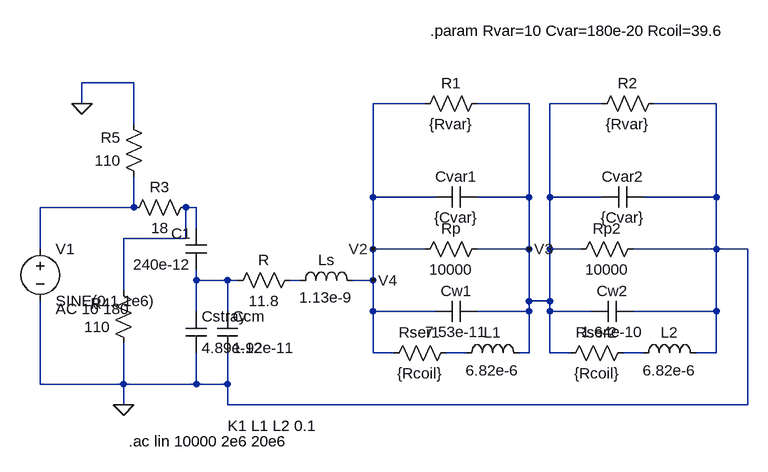
[diagram p0: schematic Coil_Model - Pi_matching_flat_current.asc]
Coil_Model - Pi_matching_flat_current.asc, the LTspice schematic file:
Version 4.1
SHEET 1 1236 680
WIRE 80 -240 0 -240
WIRE 0 -208 0 -240
WIRE 528 -208 448 -208
WIRE 688 -208 608 -208
WIRE 800 -208 720 -208
WIRE 976 -208 880 -208
WIRE 80 -176 80 -240
WIRE 448 -64 448 -208
WIRE 544 -64 448 -64
WIRE 688 -64 688 -208
WIRE 688 -64 608 -64
WIRE 720 -64 720 -208
WIRE 800 -64 720 -64
WIRE 976 -64 976 -208
WIRE 976 -64 864 -64
WIRE 80 -48 80 -96
WIRE 80 -48 -64 -48
WIRE 176 -48 160 -48
WIRE 176 -16 176 -48
WIRE 160 0 160 -48
WIRE 160 0 64 0
WIRE -64 16 -64 -48
WIRE 448 16 448 -64
WIRE 528 16 448 16
WIRE 688 16 688 -64
WIRE 688 16 608 16
WIRE 720 16 720 -64
WIRE 768 16 720 16
WIRE 976 16 976 -64
WIRE 976 16 848 16
WIRE 1024 16 976 16
WIRE 176 64 176 48
WIRE 224 64 176 64
WIRE 240 64 224 64
WIRE 336 64 320 64
WIRE 448 64 448 16
WIRE 448 64 416 64
WIRE 64 80 64 0
WIRE 688 96 688 16
WIRE 720 96 720 16
WIRE 720 96 688 96
WIRE 176 112 176 64
WIRE 224 112 224 64
WIRE 448 112 448 64
WIRE 544 112 448 112
WIRE 688 112 688 96
WIRE 688 112 608 112
WIRE 720 112 720 96
WIRE 784 112 720 112
WIRE 976 112 976 16
WIRE 976 112 848 112
WIRE 448 176 448 112
WIRE 480 176 448 176
WIRE 592 176 560 176
WIRE 688 176 688 112
WIRE 688 176 672 176
WIRE 720 176 720 112
WIRE 752 176 720 176
WIRE 864 176 832 176
WIRE 976 176 976 112
WIRE 976 176 944 176
WIRE -64 224 -64 96
WIRE 64 224 64 160
WIRE 64 224 -64 224
WIRE 176 224 176 176
WIRE 176 224 64 224
WIRE 224 224 224 176
WIRE 224 224 176 224
WIRE 64 256 64 224
WIRE 224 256 224 224
WIRE 1024 256 1024 16
WIRE 1024 256 224 256
FLAG 0 -208 0
FLAG 64 256 0
FLAG 448 16 V2
FLAG 688 16 V3
FLAG 448 64 V4
SYMBOL cap 208 112 R0
SYMATTR InstName Ccm
SYMATTR Value 1.92e-11
SYMBOL res 336 48 R90
WINDOW 0 0 56 VBottom 2
WINDOW 3 32 56 VTop 2
SYMATTR InstName R
SYMATTR Value 11.8
SYMBOL ind 320 80 R270
WINDOW 0 32 56 VTop 2
WINDOW 3 5 56 VBottom 2
SYMATTR InstName Ls
SYMATTR Value 1.13e-9
SYMBOL res 576 160 R90
WINDOW 0 0 56 VBottom 2
WINDOW 3 32 56 VTop 2
SYMATTR InstName Rser1
SYMATTR Value {Rcoil}
SYMBOL ind 576 192 R270
WINDOW 0 32 56 VTop 2
WINDOW 3 5 56 VBottom 2
SYMATTR InstName L1
SYMATTR Value 6.82e-6
SYMATTR Type ind
SYMBOL cap 608 96 R90
WINDOW 0 0 32 VBottom 2
WINDOW 3 32 32 VTop 2
SYMATTR InstName Cw1
SYMATTR Value 7.53e-11
SYMBOL res 624 0 R90
WINDOW 0 0 56 VBottom 2
WINDOW 3 32 56 VTop 2
SYMATTR InstName Rp
SYMATTR Value 10000
SYMBOL res 864 0 R90
WINDOW 0 0 56 VBottom 2
WINDOW 3 32 56 VTop 2
SYMATTR InstName Rp2
SYMATTR Value 10000
SYMBOL cap 848 96 R90
WINDOW 0 0 32 VBottom 2
WINDOW 3 32 32 VTop 2
SYMATTR InstName Cw2
SYMATTR Value 1.64e-10
SYMBOL res 848 160 R90
WINDOW 0 0 56 VBottom 2
WINDOW 3 32 56 VTop 2
SYMATTR InstName Rser2
SYMATTR Value {Rcoil}
SYMBOL ind 848 192 R270
WINDOW 0 32 56 VTop 2
WINDOW 3 5 56 VBottom 2
SYMATTR InstName L2
SYMATTR Value 6.82e-6
SYMATTR Type ind
SYMBOL cap 160 112 R0
SYMATTR InstName Cstray
SYMATTR Value 4.89e-12
SYMBOL cap 608 -80 R90
WINDOW 0 0 32 VBottom 2
WINDOW 3 32 32 VTop 2
SYMATTR InstName Cvar1
SYMATTR Value {Cvar}
SYMBOL cap 864 -80 R90
WINDOW 0 0 32 VBottom 2
WINDOW 3 32 32 VTop 2
SYMATTR InstName Cvar2
SYMATTR Value {Cvar}
SYMBOL voltage -64 0 R0
WINDOW 123 24 108 Left 2
WINDOW 39 0 0 Left 0
SYMATTR Value2 AC 10 180
SYMATTR InstName V1
SYMATTR Value SINE(0 1 1e6)
SYMBOL res 176 -64 R90
WINDOW 0 0 56 VBottom 2
WINDOW 3 32 56 VTop 2
SYMATTR InstName R3
SYMATTR Value 18
SYMBOL res 96 -80 R180
WINDOW 0 36 76 Left 2
WINDOW 3 36 40 Left 2
SYMATTR InstName R5
SYMATTR Value 110
SYMBOL res 80 176 R180
WINDOW 0 36 76 Left 2
WINDOW 3 36 40 Left 2
SYMATTR InstName R4
SYMATTR Value 110
SYMBOL cap 192 48 R180
WINDOW 0 24 56 Left 2
WINDOW 3 24 8 Left 2
SYMATTR InstName C1
SYMATTR Value 240e-12
SYMBOL res 624 -224 R90
WINDOW 0 0 56 VBottom 2
WINDOW 3 32 56 VTop 2
SYMATTR InstName R1
SYMATTR Value {Rvar}
SYMBOL res 896 -224 R90
WINDOW 0 0 56 VBottom 2
WINDOW 3 32 56 VTop 2
SYMATTR InstName R2
SYMATTR Value {Rvar}
TEXT 224 288 Left 2 !K1 L1 L2 0.1
TEXT 72 312 Left 2 !.ac lin 10000 2e6 20e6
TEXT 536 -320 Left 2 !.param Rvar=10 Cvar=180e-20 Rcoil=39.6

The netlist it stands for:
* Coil_Model - Pi_matching_flat_current.asc
Ccm N003 0 1.92e-11
R N004 N003 11.8
Ls N004 V4 1.13e-9
Rser1 N005 V4 {Rcoil}
L1 N005 V3 6.82e-6
Cw1 V3 V4 7.53e-11
Rp V3 V4 10000
Rp2 0 V3 10000
Cw2 0 V3 1.64e-10
Rser2 N006 V3 {Rcoil}
L2 N006 0 6.82e-6
Cstray N003 0 4.89e-12
Cvar1 V3 V4 {Cvar}
Cvar2 0 V3 {Cvar}
V1 N001 0 SINE(0 1 1e6) AC 10 180
R3 N002 N001 18
R5 N001 0 110
R4 0 N002 110
C1 N003 N002 240e-12
R1 V3 V4 {Rvar}
R2 0 V3 {Rvar}
K1 L1 L2 0.1
.ac lin 10000 2e6 20e6
.param Rvar=10 Cvar=180e-20 Rcoil=39.6
.backanno
.end